# EAGLE schematic Dodekatron (EAGLE 6.4)
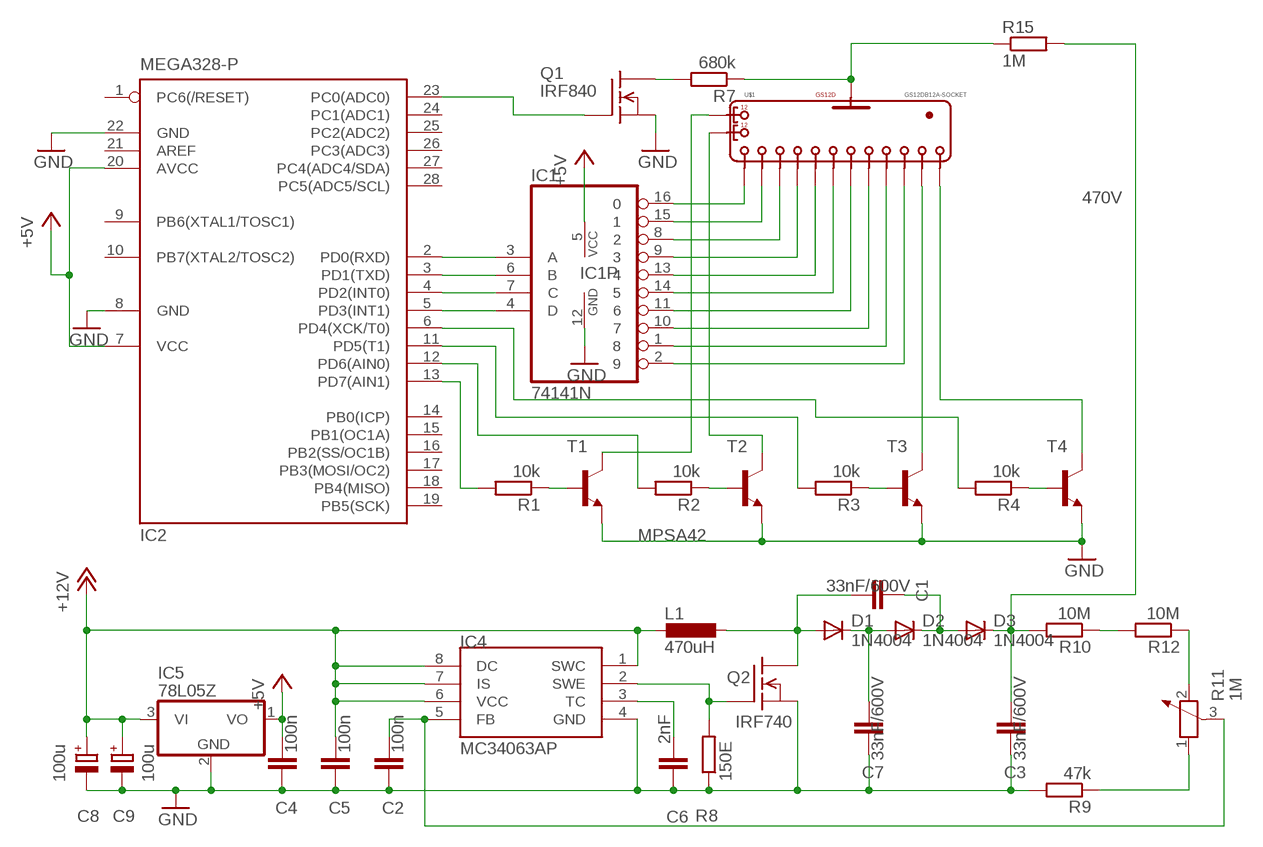
[diagram p0: schematic, sheet 1]

## Parts
C1  33nF/600V  C-EU025-025X050  [C025-025X050]
C2  100n  C-EU025-025X050  [C025-025X050]
C3  33nF/600V  C-EU025-025X050  [C025-025X050]
C4  100n  C-EU025-025X050  [C025-025X050]
C5  100n  C-EU025-025X050  [C025-025X050]
C6  2nF  C-EU025-025X050  [C025-025X050]
C7  33nF/600V  C-EU025-025X050  [C025-025X050]
C8  100u  CPOL-EUTAP5-80  [TAP5-80]
C9  100u  CPOL-EUTAP5-80  [TAP5-80]
D1  1N4004  [DO41-10]
D2  1N4004  [DO41-10]
D3  1N4004  [DO41-10]
IC1  74141N  [DIL16]
IC2  MEGA328-P  MEGA8-P  [DIL28-3]
IC4  MC34063AP  [DIL08]
IC5  78L05Z  [TO92]
L1  470uH  L-EU6000-XXX-RC  [6000-XXXX-RC]
Q1  IRF840  [TO220]
Q2  IRF740  IRF620  [TO220]
R1  10k  R-EU_0207/10  [0207/10]
R2  10k  R-EU_0207/10  [0207/10]
R3  10k  R-EU_0207/10  [0207/10]
R4  10k  R-EU_0207/10  [0207/10]
R7  680k  R-EU_0207/10  [0207/10]
R8  150E  R-EU_0207/10  [0207/10]
R9  47k  R-EU_0207/10  [0207/10]
R10  10M  R-EU_0207/10  [0207/10]
R11  1M  POTENTIOMETER_PT_SPIN  [PT-SPIN]
R12  10M  R-EU_0207/10  [0207/10]
R15  1M  R-EU_0207/10  [0207/10]
T1  MPSA42  MPSA42-NPN-TO92-CBE  [TO92-CBE]
T2  MPSA42-NPN-TO92-CBE  [TO92-CBE]
T3  MPSA42-NPN-TO92-CBE  [TO92-CBE]
T4  MPSA42-NPN-TO92-CBE  [TO92-CBE]
U$1  GS12DB12A-SOCKET  [B12A-SOCKET]

## Nets
470V: C3.1 D3.C R10.2 R15.2
+5V: C4.1 IC1.5(VCC) IC2.7(VCC) IC2.20(AVCC) IC5.1(VO)
+12V: C5.1 C8.+ C9.+ IC4.1(SWC) IC4.6(VCC) IC4.7(IS) IC4.8(DC) IC5.3(VI) L1.2
/BLANK: IC2.23(PC0(ADC0)) Q1.1(G)
GND: C2.2 C3.2 C4.2 C5.2 C6.2 C7.2 C8.- C9.- IC1.12(GND) IC2.8(GND) IC2.22(GND) IC4.4(GND) IC5.2(GND) Q1.3(S) Q2.3(S) R8.1 R9.2 T1.E T2.E T3.E T4.E
N$1: C7.1 D1.C D2.A
N$2: C1.2 D2.C D3.A
N$4: T3.C U$1.P$12
N$5: R10.1 R12.2
N$6: R7.1 R15.1 U$1.P$0(P$A)
N$7: R11.2 R12.1
N$8: R9.1 R11.1
N$9: Q1.2(D) R7.2
N$10: C6.1 IC4.3(TC)
N$11: IC1.3(A) IC2.2(PD0(RXD))
N$12: IC1.6(B) IC2.3(PD1(TXD))
N$13: IC1.7(C) IC2.4(PD2(INT0))
N$14: IC1.4(D) IC2.5(PD3(INT1))
N$15: R1.1 T1.B
N$16: R2.1 T2.B
N$17: R3.1 T3.B
N$18: R4.1 T4.B
N$19: IC2.13(PD7(AIN1)) R1.2
N$20: IC2.12(PD6(AIN0)) R2.2
N$21: IC2.11(PD5(T1)) R3.2
N$22: IC2.6(PD4(XCK/T0)) R4.2
N$23: IC4.2(SWE) Q2.1(G) R8.2
N$24: C1.1 D1.A L1.1 Q2.2(D)
N$25: C2.1 IC4.5(FB) R11.3
N$27: IC1.13 U$1.P$6
N$28: IC1.14 U$1.P$7
N$29: IC1.11 U$1.P$8
N$30: IC1.10 U$1.P$9
N$31: IC1.1 U$1.P$10
N$32: IC1.2 U$1.P$11
N$34: T4.C U$1.P$1
N$35: T2.C U$1.P$GRN(P$G2)
N$36: T1.C U$1.P$YEL(P$G1)
N$47: IC1.16 U$1.P$2
N$48: IC1.15 U$1.P$3
N$49: IC1.8 U$1.P$4
N$50: IC1.9 U$1.P$5
Unconnected: IC2.1(PC6(/RESET)) IC2.9(PB6(XTAL1/TOSC1)) IC2.10(PB7(XTAL2/TOSC2)) IC2.14(PB0(ICP)) IC2.15(PB1(OC1A)) IC2.16(PB2(SS/OC1B)) IC2.17(PB3(MOSI/OC2)) IC2.18(PB4(MISO)) IC2.19(PB5(SCK)) IC2.21(AREF) IC2.24(PC1(ADC1)) IC2.25(PC2(ADC2)) IC2.26(PC3(ADC3)) IC2.27(PC4(ADC4/SDA)) IC2.28(PC5(ADC5/SCL))

## Library data of the parts
C1-C7 = rcl:C-EU: CAPACITOR, European symbol
C8 C9 = rcl:CPOL-EU: POLARIZED CAPACITOR, European symbol
D1-D3 = diode:1N4004: DIODE general purpose rectifier, 1 A
IC1 = 74xx-eu:74*141: BCD to decimal DECODER/DRIVER
IC2 = atmel:MEGA8-P: MICROCONTROLLER 8 Kbytes FLASH, 1 kbytes SRAM, 512 bytes EEPROM, USART, 4-channel 10 bit ADC, 2-channel 8 bit ADC Pin compatible with Atmega48, ATMega88, ATMega168 Source: avr.lbr; OC_FARNELL: unknown; OC_NEWARK: unknown
IC4 = mc34063:MC34063
IC5 = linear:78*: Positive VOLTAGE REGULATOR Source: http://cache.national.com/ds/LM/LM78L05.pdf http://www.fairchildsemi.com/ds/LM/LM7805.pdf
L1 = rcl:L-EU: INDUCTOR, European symbol
Q1 = transistor-fet:IRF840: N-Channel Enhancement MOSFET (HEXFET); 500V; 8A; 0,85Ohm
Q2 = transistor-fet:IRF620: N-Channel Enhancement MOSFET (HEXFET); 200V; 5,2A; 0,8Ohm
R1-R4 R7-R10 R12 R15 = rcl:R-EU_: RESISTOR, European symbol
R11 = rcl:POTENTIOMETER_: Potentiometer
T1-T4 = transistor:*-NPN-: NPN Transistror BF959 corrected 2008.03.06
U$1 = nixie_tube:GS12D